# EAGLE design krajBB-Mojžiš_Matej2_2 (EAGLE 7.7.0)
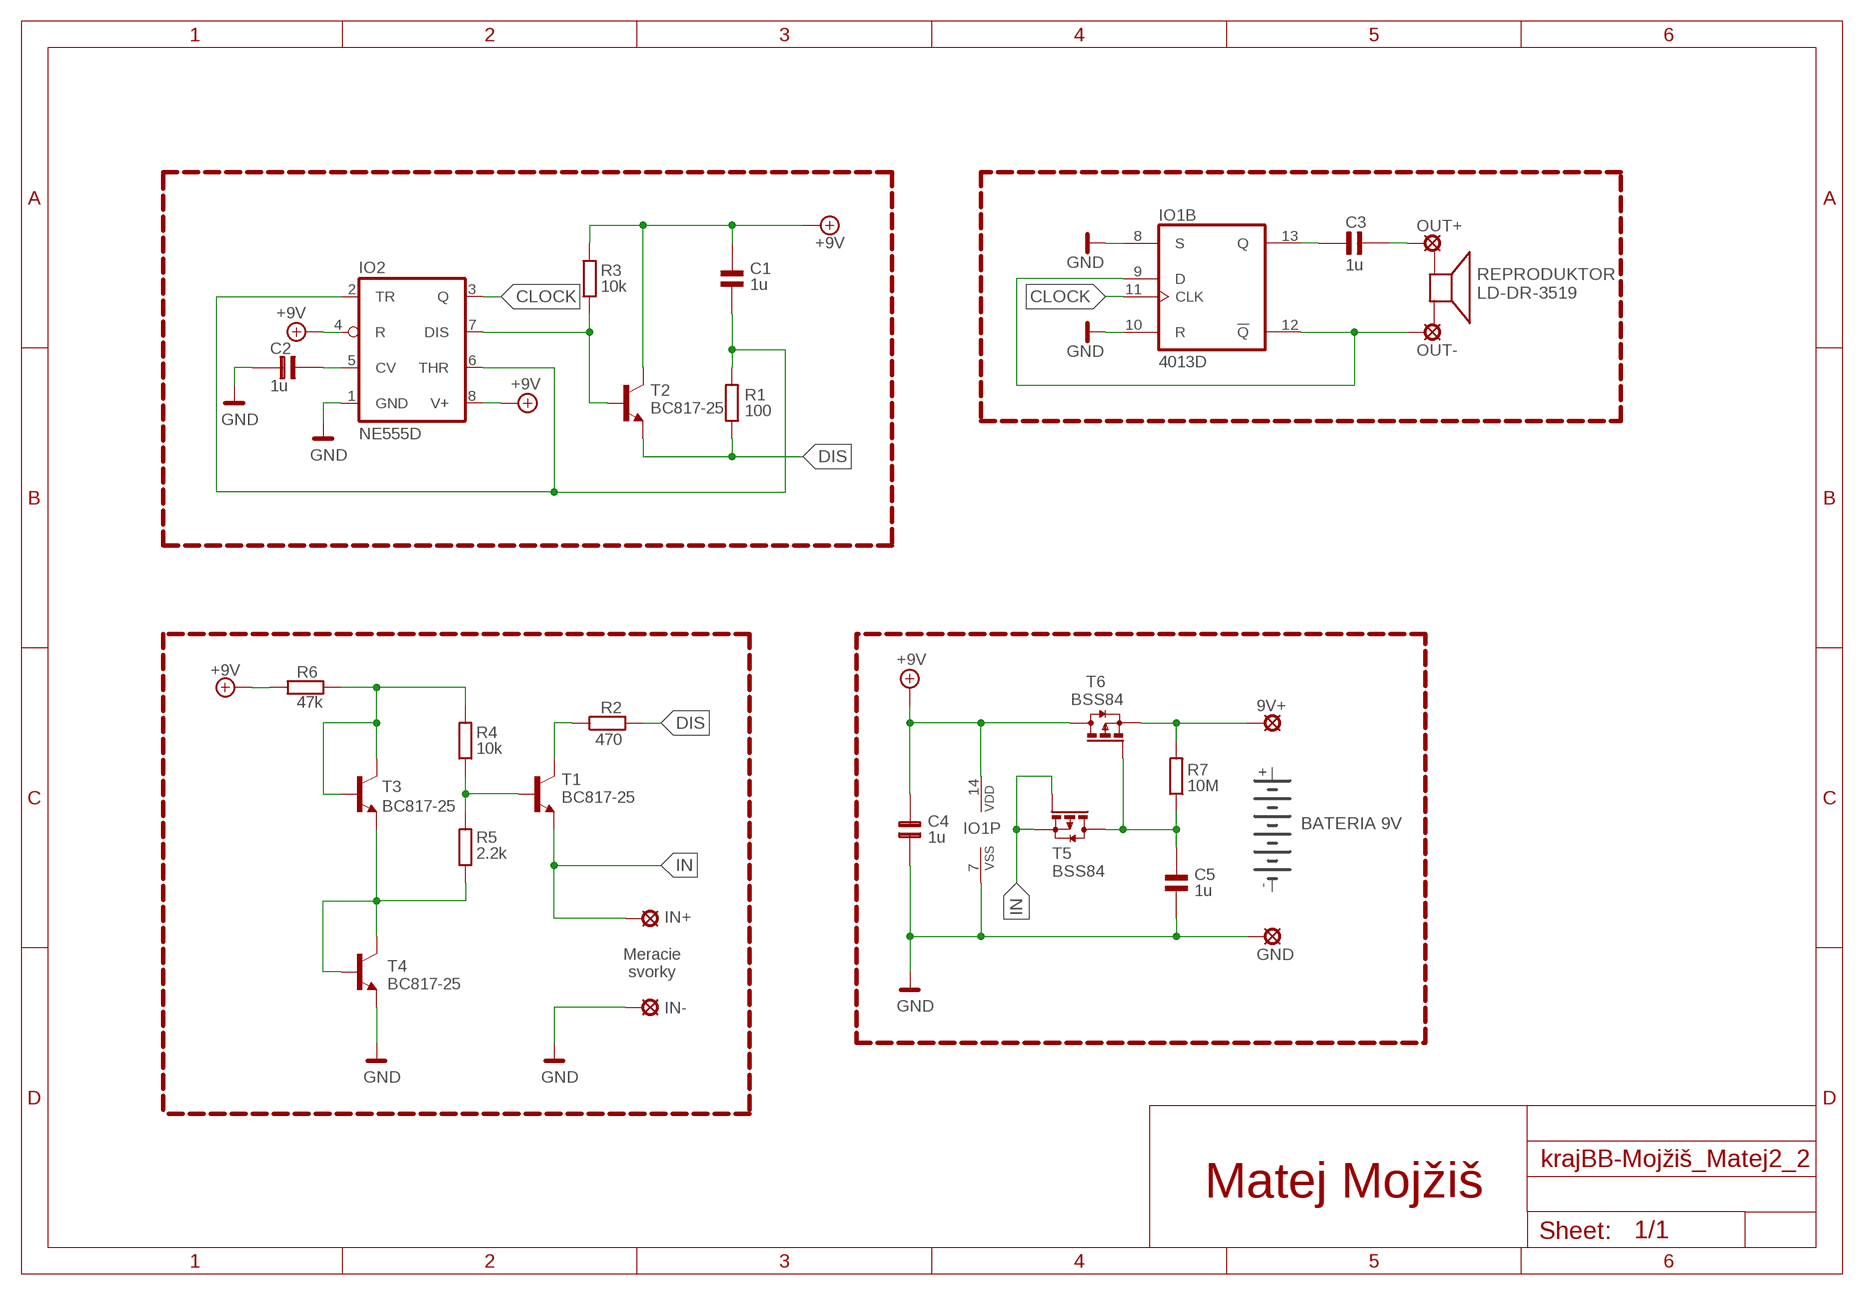
[diagram p0: schematic, sheet 1]

## Parts
9V+  SMD3X3  [SMD3X3]
C1  1u  C1206TOP  [1206]
C2  1u  C1206TOP  [1206]
C3  1u  C1206TOP  [1206]
C4  1u  C1206TOP  [1206]
C5  1u  C1206TOP  [1206]
GND  SMD3X3  [SMD3X3]
IN+  SMD3X3  [SMD3X3]
IN-  SMD3X3  [SMD3X3]
IO1  4013D  [SO14]
IO2  NE555D  [SO08]
OUT+  SMD3X3  [SMD3X3]
OUT-  SMD3X3  [SMD3X3]
R1  100  R1206TOP  [1206]
R2  470  R1206TOP  [1206]
R3  10k  R1206TOP  [1206]
R4  10k  R1206TOP  [1206]
R5  2.2k  R1206TOP  [1206]
R6  47k  R1206TOP  [1206]
R7  10M  R1206TOP  [1206]
REPRODUKTOR  LD-DR-3519  [LD-DR-3519]
T1  BC817-25  BC817-25SMD  [SOT23-BEC]
T2  BC817-25  BC817-25SMD  [SOT23-BEC]
T3  BC817-25  BC817-25SMD  [SOT23-BEC]
T4  BC817-25  BC817-25SMD  [SOT23-BEC]
T5  BSS84  [SOT23]
T6  BSS84  [SOT23]
U$1  9VBATTERY  [9VBATTERY]

## Nets
+9V: C1.2 C4.2 IO1.14(P:VDD) IO2.4(R) IO2.8(V+) R3.2 R6.2 T2.C T6.3(D)
CLOCK: IO1.11(B:CLK) IO2.3(Q)
DIS: R1.1 R2.2 T2.E
GND: C2.1 C4.1 C5.1 GND.P$1(MP) IN-.P$1(MP) IO1.7(P:VSS) IO1.8(B:S) IO1.10(B:R) IO2.1(GND) T4.E
IN: IN+.P$1(MP) T1.E T5.1(G) T5.2(S)
N$1: IO2.7(DIS) R3.1 T2.B
N$5: R4.2 R6.1 T3.B T3.C
N$6: C2.2 IO2.5(CV)
N$8: R4.1 R5.2 T1.B
N$9: R2.1 T1.C
N$13: C5.2 R7.1 T5.3(D) T6.1(G)
N$15: C3.1 IO1.13(B:Q)
N$17: R5.1 T3.E T4.B T4.C
N$18: C1.1 IO2.2(TR) IO2.6(THR) R1.2
REP: C3.2 OUT+.P$1(MP)
REP+: IO1.9(B:D) IO1.12(B:!Q) OUT-.P$1(MP)
VIN: 9V+.P$1(MP) R7.2 T6.2(S)
Unconnected: IO1.1(A:Q) IO1.2(A:!Q) IO1.3(A:CLK) IO1.4(A:R) IO1.5(A:D) IO1.6(A:S) REPRODUKTOR.P$1 REPRODUKTOR.P$2

## Notes on the sheet
- BATERIA 9V
- Meracie
  svorky
- Matej Mojžiš

## Library data of the parts
9V+ GND IN+ IN- OUT+ OUT- = solpad:SMD3X3
C1-C5 = rcl:C1206: 1206 capacitor, top layer
IO1 = 40xx:4013: Dual D FLIP FLOP, set/reset
IO2 = linear:*555: TIMER
R1-R7 = rcl:R1206: 1206 resistor, top layer
REPRODUKTOR = buzzer:LD-DR-3519
T1-T4 = transistor-npn:BC817*: NPN Transistor
T5 T6 = transistor-small-signal:BSS84: P-CHANNEL MOS FET
U$1 = battery:9VBATTERY: 9V battery symbol and placeholder

## Board
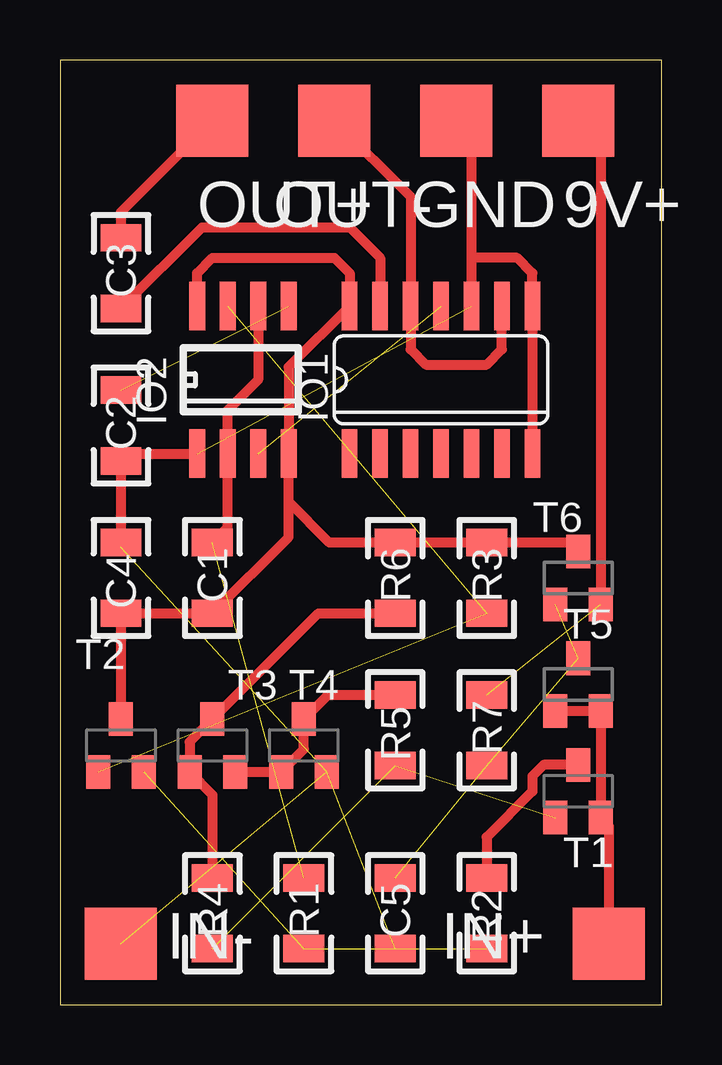
[diagram p1: board, top side]

Size 25.07 x 39.36 mm. Coordinates in mm from the lower left corner, seen from the top.
Outline: 0,0 25.07,0 25.07,39.36 0,39.36 0,0
Copper layers (1*16): Top 0.035mm / dielectric 1.5mm / Bottom 0.035mm
Design rules "default *": minimum track width 10mil, minimum drill 24mil, track to track 8mil, track to pad 8mil, pad to pad 8mil, via to via 8mil, smd to smd 8mil, copper to edge 16mil, drill to drill 8mil, minimum pad ring 10mil, minimum via ring 8mil, stop-mask expansion 4mil, vias tented up to drill 0mil, thermal gap 10mil

### Footprints (pad centres in the part's own frame; a part is rotated, then mirrored left to right if it is on the bottom)
SMD3X3 = smd 3 x 3: P$1 0,0
1206 = smd 1.143 x 1.702: 1 -1.473,0; 2 1.473,0
SO14 = smd 0.66 x 2.032: 1 -3.81,-3.073; 2 -2.54,-3.073; 3 -1.27,-3.073; 4 0,-3.073; 5 1.27,-3.073; 6 2.54,-3.073; 7 3.81,-3.073; 8 3.81,3.073; 9 2.54,3.073; 10 1.27,3.073; 11 0,3.073; 12 -1.27,3.073; 13 -2.54,3.073; 14 -3.81,3.073
SO08 = smd 0.66 x 2.032: 1 -1.905,-3.073; 2 -0.635,-3.073; 3 0.635,-3.073; 4 1.905,-3.073; 5 1.905,3.073; 6 0.635,3.073; 7 -0.635,3.073; 8 -1.905,3.073
LD-DR-3519 = drill 1 pad 1.93 long: P$1 -3,-15; P$2 3,-15
SOT23-BEC = smd 1 x 1.4: B -0.95,-1.1; C 0,1.1; E 0.95,-1.1
SOT23 = smd 1 x 1.4: 1 -0.95,-1.1; 2 0.95,-1.1; 3 0,1.1

### Placement (x,y rotation side)
9V+  21.59,36.83 0 top
C1  6.35,17.78 270 top
C2  2.54,24.13 90 top
C3  2.54,30.48 90 top
C4  2.54,17.78 270 top
C5  13.97,3.81 90 top
GND  16.51,36.83 0 top
IN+  22.86,2.54 0 top
IN-  2.54,2.54 0 top
IO1  15.88,26.04 0 top
IO2  7.62,26.04 0 top
OUT+  6.35,36.83 0 top
OUT-  11.43,36.83 0 top
R1  10.16,3.81 90 top
R2  17.78,3.81 270 top
R3  17.78,17.78 90 top
R4  6.35,3.81 90 top
R5  13.97,11.43 270 top
R6  13.97,17.78 90 top
R7  17.78,11.43 90 top
REPRODUKTOR  48.9,56.52 0 top  (outside the outline)
T1  21.59,8.89 0 top
T2  2.54,10.79 0 top
T3  6.35,10.79 0 top
T4  10.16,10.79 0 top
T5  21.59,13.34 0 top
T6  21.59,17.78 0 top
U$1  44.45,24.13 0 top  (outside the outline)

### Tracks (layer width: path | path; a pad name or v marks a point on that pad's centre or on a via)
+9V
  Top 0.406: T6.3 21.59,19.05 21.39,19.25 R3.2 R6.2 11.23,19.25 9.53,20.95 IO2.4 | IO2.4 9.53,26.57 IO1.14 12.06,30.48 11.43,31.11 6.35,31.11 5.71,30.48 IO2.8 | T2.C C4.2 C1.2 9.53,19.48 IO2.4
CLOCK  (1 unrouted)
DIS  (2 unrouted)
GND  (4 unrouted)
  Top 0.406: 17.14,31.11 17.14,31.75 17.14,32.38 17.14,36.2 GND.P$1 | 17.14,31.11 IO1.10 | 17.14,31.11 19.05,31.11 19.68,30.48 IO1.8 IO1.7 | IO2.1 2.85,22.96 C2.1 C4.1 2.54,19.05
IN
  Top 0.406: IN+.P$1 22.86,7.47 T1.E T5.2 T5.1
N$1  (2 unrouted)
N$5
  Top 0.406: R4.2 6.35,8.74 T3.B 5.4,10.95 T3.C 10.76,16.31 R6.1
N$6  (1 unrouted)
N$8  (2 unrouted)
N$9
  Top 0.406: 17.78,5.08 R2.1 17.78,6.99 19.68,8.89 19.68,9.53 20.15,9.99 T1.C
N$13  (3 unrouted)
N$15
  Top 0.406: C3.1 5.92,32.38 12.06,32.38 13.34,31.11 IO1.13
N$17
  Top 0.406: T3.E T4.B 10.16,10.64 T4.C 11.17,12.9 R5.1
N$18  (1 unrouted)
  Top 0.406: C1.1 6.99,19.89 IO2.2 6.99,24.77 8.26,26.04 IO2.6
REP
  Top 0.406: OUT+.P$1 2.54,33.02 C3.2 2.54,31.75
REP+
  Top 0.406: 14.61,29.84 IO1.12 | IO1.12 14.61,27.3 15.24,26.67 17.78,26.67 18.41,27.3 IO1.9 | OUT-.P$1 14.61,33.66 IO1.12
VIN  (1 unrouted)
  Top 0.406: T6.2 22.54,31.75 22.54,32.07 22.54,35.88 9V+.P$1